# EAGLE design 255SB to Switch SMD double (EAGLE 9.4.0)
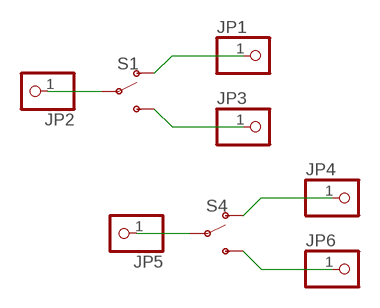
[diagram p0: schematic, sheet 1]

## Parts
JP1  PINHD-1X01_2.54-SMD  [1X01SMD]
JP2  PINHD-1X01_2.54-SMD  [1X01SMD]
JP3  PINHD-1X01_2.54-SMD  [1X01SMD]
JP4  PINHD-1X01_2.54-SMD  [1X01SMD]
JP5  PINHD-1X01_2.54-SMD  [1X01SMD]
JP6  PINHD-1X01_2.54-SMD  [1X01SMD]
S1  SWITCH-SPDT-SMD-AYZ0202  [SWITCH_DPDT_SMD_AYZ0202]
S4  SWITCH-SPDT-SMD-AYZ0202  [SWITCH_DPDT_SMD_AYZ0202]

## Nets
N$1: JP2.1 S1.2(P)
N$2: JP1.1 S1.1(O)
N$3: JP3.1 S1.3(S)
N$5: JP5.1 S4.2(P)
N$6: JP4.1 S4.1(O)
N$7: JP6.1 S4.3(S)

## Library data of the parts
JP1-JP6 = pinhead-2:PINHD-1X01: PIN HEADER
S1 S4 = SparkFun-Switches:SWITCH-SPDT: Single Pole, Double Throw (SPDT) Switch Single-pole, double-throw (SPDT) switch. Variant Overview SMD-AYZ0202 Surface Mount DPDT Switch <https://www.sparkfun.com/products/597> (COM-00597) Used on e.g. LilyPad Arduino USB - ATmega32U4 Board <https://www.sparkfun.com/products/12049> PTH-11.6X4.0MM SPDT Mini Power Switch <https://www.sparkfun.com/products/102> (COM-00102) Used on e.g. SparkFun Simon Says - Through-Hole Soldering Kit <https://www.sparkfun.com/products/10547> (KIT-10547) PTH-11.6X4.0MM-KIT KIT version of SPDT Mini Power Switch - Simplifies soldering by removing tStop of switch pins - only one side can be soldered. PTH-11.6X4.0MM-LOCK LOCK version of SPDT Mini Power Switch - Offset pins hold switch in place for easier soldering. SMD-RIGHT-ANGLE Surface Mount Right Angle Switch <https://www.sparkfun.com/products/10860> (COM-10860) Used on e.g. SparkFun ESP8266 Thing <https://www.sparkfun.com/products/13231>; PROD_ID: SWCH-08179; SF_ID: COM-00597

## Board
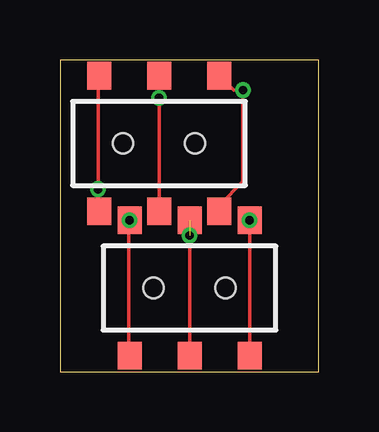
[diagram p1: board, top side]
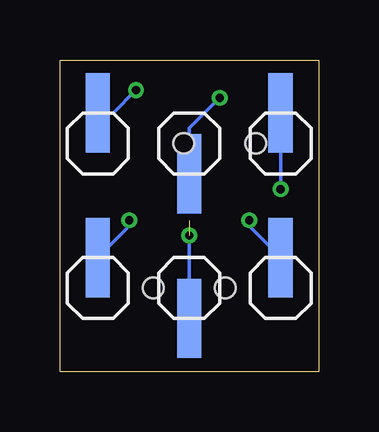
[diagram p2: board, bottom side, seen from below]

Size 10.78 x 13.01 mm. Coordinates in mm from the lower left corner, seen from the top.
Outline: 0,0 10.78,0 10.78,13.01 0,13.01 0,0
Copper layers (1*16): Top 0.035mm / dielectric 1.5mm / Bottom 0.035mm
Design rules "dirtypcbs_2_layer": minimum track width 5mil, minimum drill 12mil, track to track 5mil, track to pad 5mil, pad to pad 5mil, via to via 5mil, smd to smd 0mil, copper to edge 10mil, drill to drill 10mil, minimum pad ring 10mil, minimum via ring 6mil, stop-mask expansion 2mil, vias tented up to drill 25mil, thermal gap 10mil

### Footprints (pad centres in the part's own frame; a part is rotated, then mirrored left to right if it is on the bottom)
1X01SMD = smd 1.016 x 3.302: 1 -1.27,1.27
SWITCH_DPDT_SMD_AYZ0202 = smd 1 x 1.15: 1 -2.5,2.825; 2 0,2.825; 3 2.5,2.825; 4 -2.5,-2.825; 5 0,-2.825; 6 2.5,-2.825 | hole 0.85: 1.5,0; -1.5,0

### Placement (x,y rotation side)
JP1  0.32,3.49 0 bottom
JP2  6.67,3.49 180 bottom
JP3  7.94,3.49 0 bottom
JP4  0.32,9.53 0 bottom
JP5  6.67,9.53 180 bottom
JP6  7.94,9.53 0 bottom
S1  5.4,3.49 0 top
S4  4.13,9.53 0 top

### Tracks (layer width: path | path; a pad name or v marks a point on that pad's centre or on a via)
N$1  (via drill 0.35)  (1 unrouted)
  Top 0.152: v5.4,5.68 5.4,0.64
  Bottom 0.152: JP2.1 v5.4,5.68
N$2  (via drill 0.35)
  Top 0.152: S1.1 2.86,6.28 2.86,0.64
  Bottom 0.152: JP1.1 2.9,6.07 S1.1
  other vias: 2.9,6.32
N$3  (via drill 0.35)
  Top 0.152: S1.3 7.9,0.64
  Bottom 0.152: JP3.1 7.9,6.07 S1.3
  other vias: 7.9,6.32
N$5  (via drill 0.35)
  Top 0.152: S4.2 v4.13,11.43 4.13,6.67
  Bottom 0.152: JP5.1 5.4,10.16 v4.13,11.43
N$6  (via drill 0.35)
  Top 0.152: 1.59,6.67 v1.59,7.62 1.59,12.31 S4.1
  Bottom 0.152: JP4.1 v1.59,7.62
N$7  (via drill 0.35)
  Top 0.152: S4.3 7.23,11.75 v7.62,11.75 7.62,7.94 6.67,6.99
  Bottom 0.152: JP6.1 8.57,10.79 v7.62,11.75